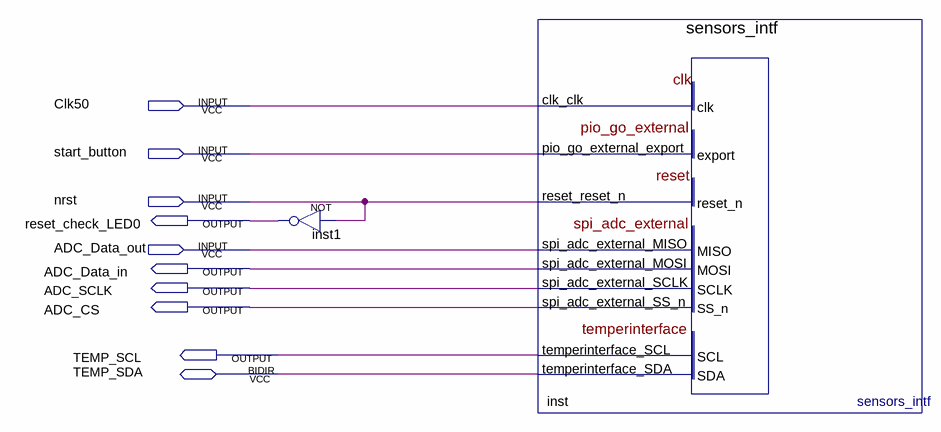
[diagram p0: schematic sheet]
// Quartus schematic sensorl_interface.bdf as structural Verilog: 2 symbols, 10 pins
module sensorl_interface (
  input  Clk50,
  input  start_button,
  input  nrst,
  input  ADC_Data_out,
  inout  TEMP_SDA,
  output reset_check_LED0,
  output ADC_Data_in,
  output ADC_SCLK,
  output ADC_CS,
  output TEMP_SCL
);

  not inst1 (reset_check_LED0, nrst);
  sensors_intf inst (
    .clk_clk(Clk50), .pio_go_external_export(start_button), .reset_reset_n(nrst),
    .spi_adc_external_MISO(ADC_Data_out), .spi_adc_external_MOSI(ADC_Data_in),
    .spi_adc_external_SCLK(ADC_SCLK), .spi_adc_external_SS_n(ADC_CS), .temperinterface_SCL(TEMP_SCL),
    .temperinterface_SDA(TEMP_SDA));
endmodule
